# EAGLE schematic schm1 (EAGLE 5.04)
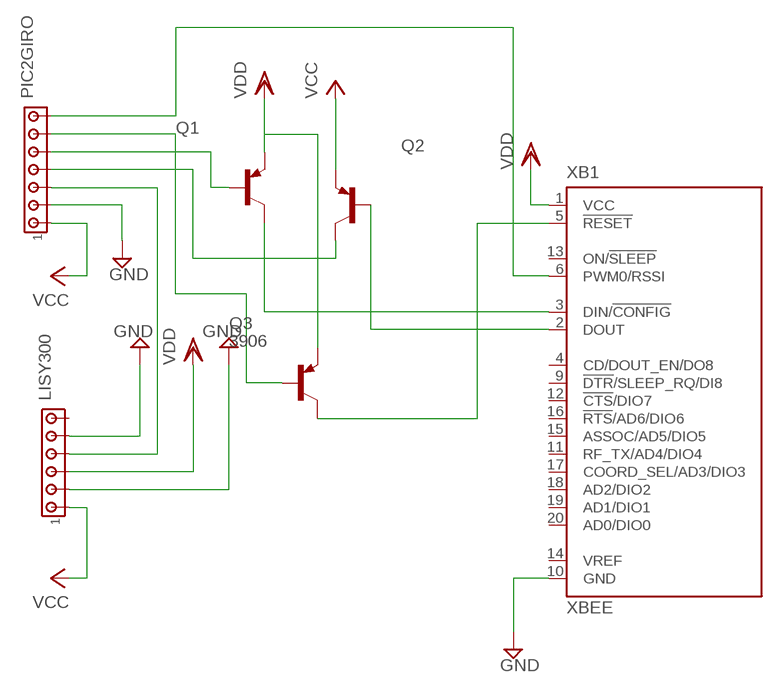
[diagram p0: schematic, sheet 1]

## Parts
LISY300  MTA06-100  [10X06MTA]
PIC2GIRO  MTA07-100  [10X07MTA]
Q1  2N3906  [TO92]
Q2  2N3906  [TO92]
Q3  3906  2N3906  [TO92]
XB1  XBEE  [XBEE]

## Nets
GND: LISY300.2 LISY300.5 PIC2GIRO.2 XB1.10(GND)
N$1: Q3.1(C) XB1.5(!RESET)
N$2: LISY300.3 PIC2GIRO.3
N$3: PIC2GIRO.4 Q2.1(C)
N$4: Q2.2(B) XB1.2(DOUT)
N$5: Q1.1(C) XB1.3(DIN/!CONFIG)
N$6: PIC2GIRO.7 XB1.6(PWM0/RSSI)
N$7: PIC2GIRO.5 Q1.2(B)
N$8: PIC2GIRO.6 Q3.2(B)
VCC: LISY300.6 PIC2GIRO.1 Q2.3(E)
VDD: LISY300.4 Q1.3(E) Q3.3(E) XB1.1(VCC)
Unconnected: LISY300.1 XB1.4(CD/DOUT_EN/DO8) XB1.9(!DTR!/SLEEP_RQ/DI8) XB1.11(RF_TX/AD4/DIO4) XB1.12(!CTS!/DIO7) XB1.13(ON/!SLEEP) XB1.14(VREF) XB1.15(ASSOC/AD5/DIO5) XB1.16(!RTS!/AD6/DIO6) XB1.17(COORD_SEL/AD3/DIO3) XB1.18(AD2/DIO2) XB1.19(AD1/DIO1) XB1.20(AD0/DIO0)

## Library data of the parts
LISY300 = con-amp:MTA06-100: AMP connector
PIC2GIRO = con-amp:MTA07-100: AMP connector
Q1-Q3 = transistor-pnp:2N3906: PNP Transistor
XB1 = maxstream:XBEE: XBee (TM) /XBee-PRO(TM) OEM RF Modules Source: MaxStream, Inc. xbee_productmanual.pdf